# Altium schematic sheet Sheet0-MCU.SchDoc
size A3; SheetNumber: 1; SheetTotal: 4
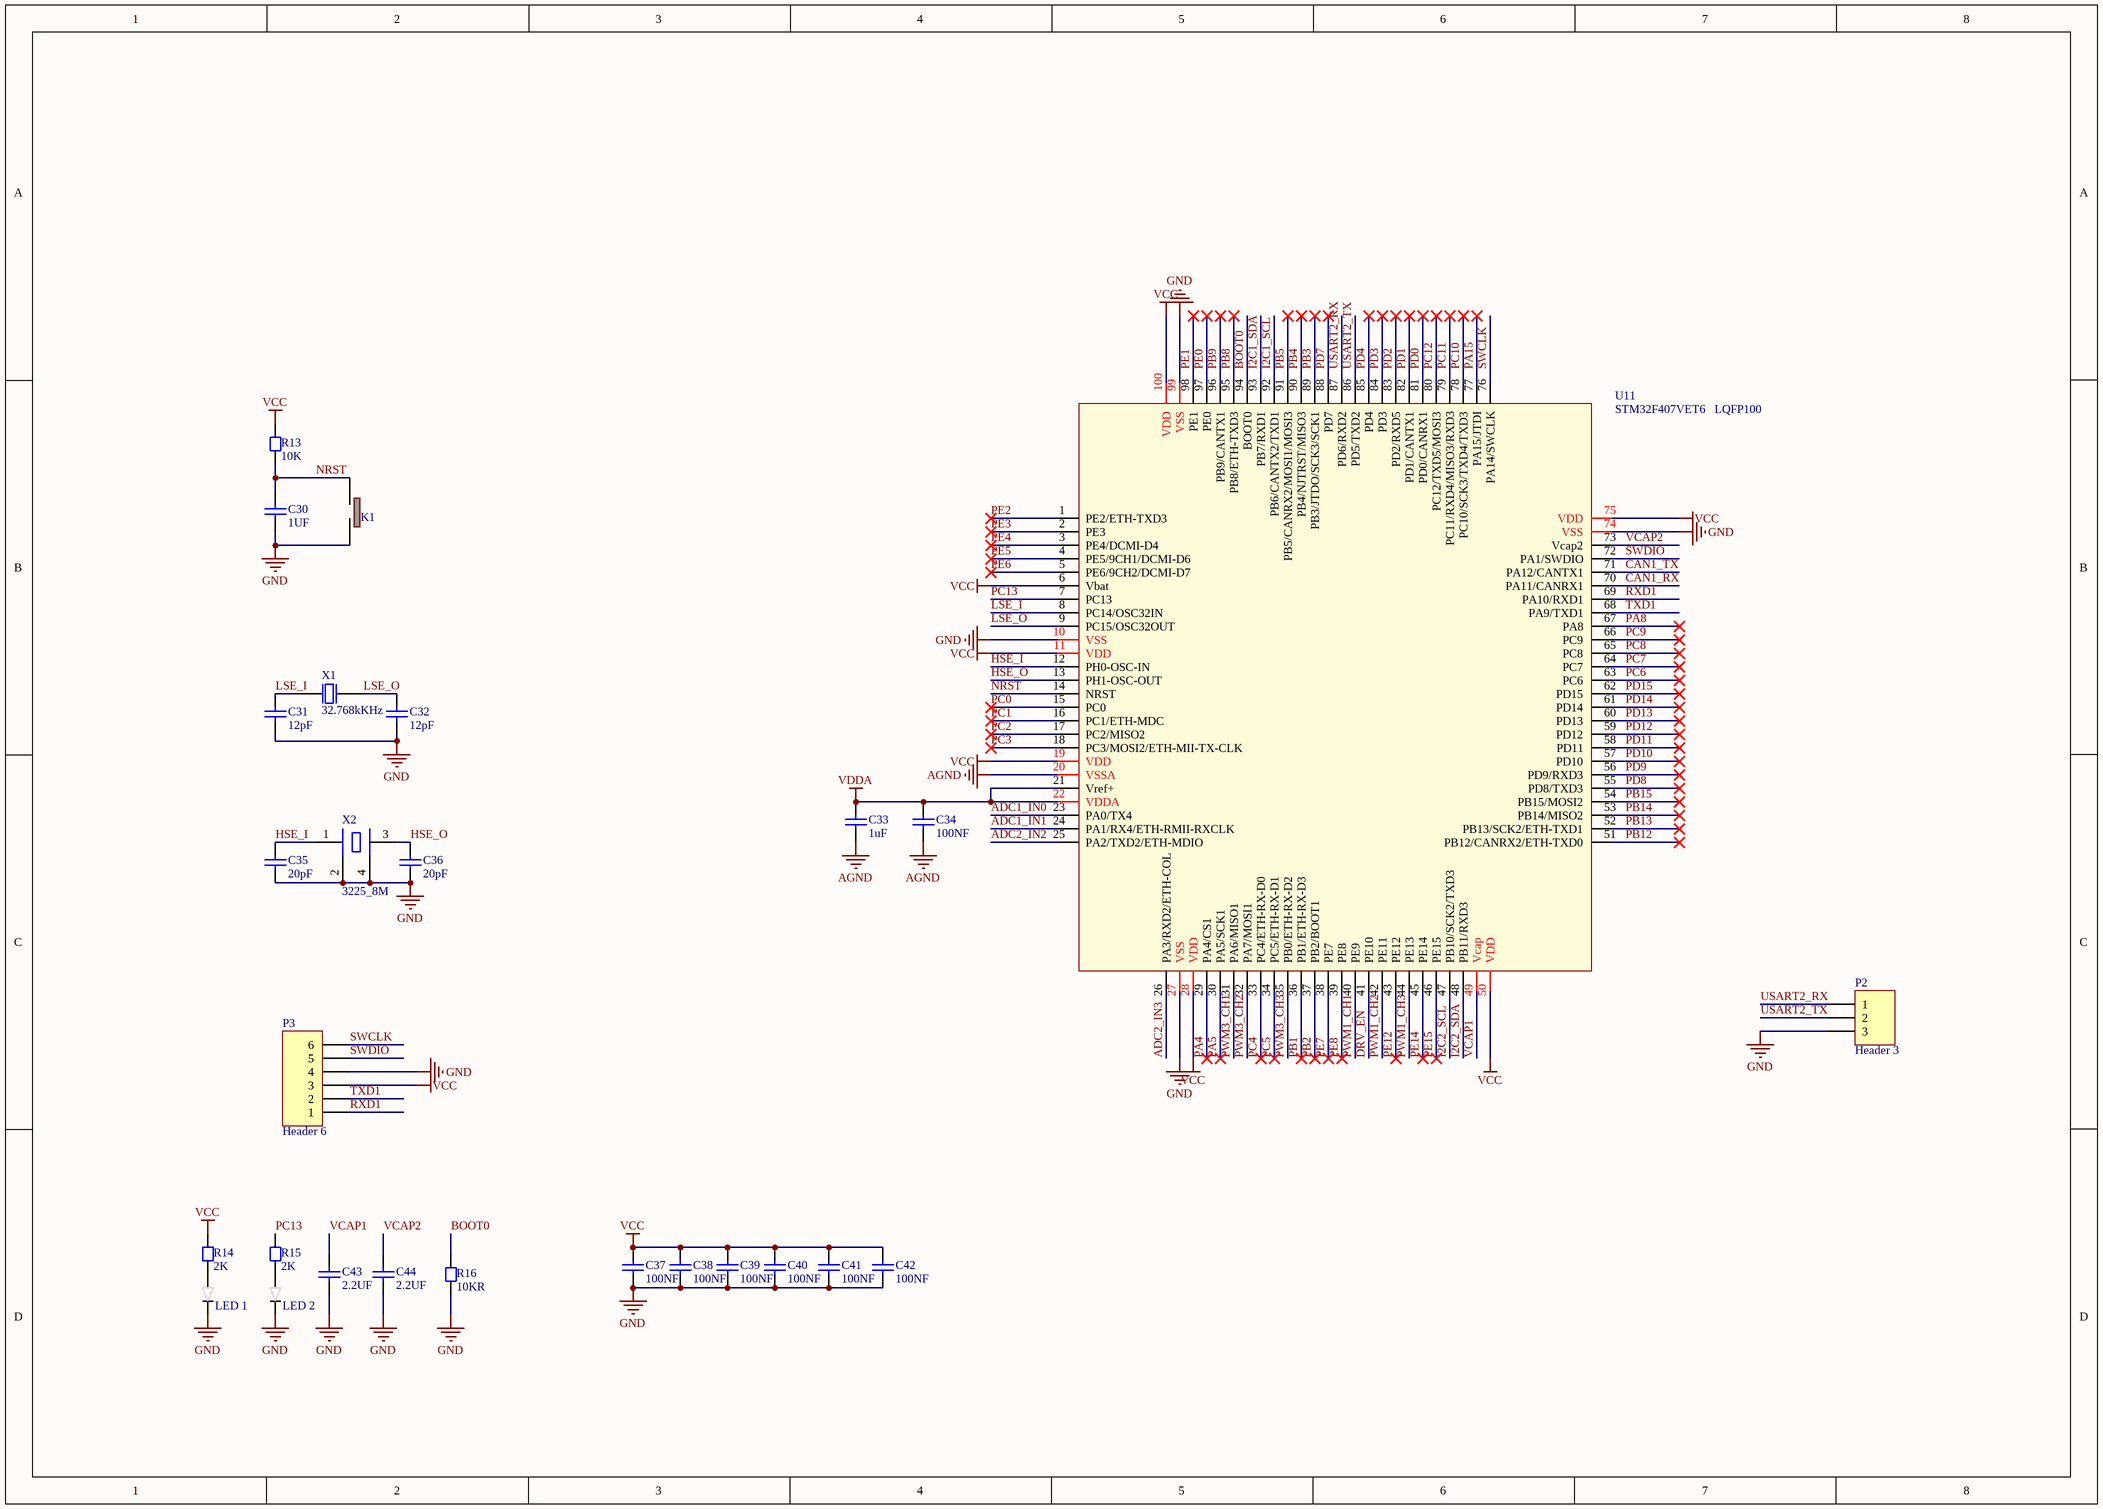
[diagram p0: Sheet0-MCU.SchDoc]

## Parts
C30  1UF  [CC1608-0603]
C31  12pF  [CC1608-0603]
C32  12pF  [CC1608-0603]
C33  1uF  [CC1608-0603]
C34  100NF  [CC1608-0603]
C35  20pF  [CC1608-0603]
C36  20pF  [CC1608-0603]
C37  100NF  [CC1608-0603]
C38  100NF  [CC1608-0603]
C39  100NF  [CC1608-0603]
C40  100NF  [CC1608-0603]
C41  100NF  [CC1608-0603]
C42  100NF  [CC1608-0603]
C43  2.2UF  [CC1608-0603]
C44  2.2UF  [CC1608-0603]
K1  KEY 3*4  [KEY 3*4]  (value not drawn)
LED_1  LED 0603  [LED 0603]  (value not drawn)
LED_2  LED 0603  [LED 0603]  (value not drawn)
P2  Header 3  [HX2.54-3]
P3  Header 6  [HDR1X6]
R13  10K  [CR1608-0603]
R14  2K  [CR1608-0603]
R15  2K  [CR1608-0603]
R16  10KR  [CR1608-0603]
U11  STM32F407VET6   LQFP100  [TQFP100]
X1  32.768kKHz  [XTAL-3215]
X2  3225_8M  [XTAL-3225]

## Nets
AGND: C33.1 C34.1 U11.20(VSSA)
GND: C30.1 C31.1 C32.1 C35.1 C36.1 C37.1 C38.1 C39.1 C40.1 C41.1 C42.1 C43.1 C44.1 K1.2 LED_1.2 LED_2.2 P2.3 P3.4 R16.1 U11.10(VSS) U11.27(VSS) U11.74(VSS) U11.99(VSS) X2.2(GND) X2.4(GND)
VCC: C37.2 C38.2 C39.2 C40.2 C41.2 C42.2 P3.3 R13.2 R14.2 U11.6(Vbat) U11.11(VDD) U11.19(VDD) U11.28(VDD) U11.50(VDD) U11.75(VDD) U11.100(VDD)
VDDA: C33.2 C34.2 U11.21(Vref+) U11.22(VDDA)
ADC1_IN0: U11.23(PA0/TX4)
ADC1_IN1: U11.24(PA1/RX4/ETH-RMII-RXCLK)
ADC2_IN2: U11.25(PA2/TXD2/ETH-MDIO)
ADC2_IN3: U11.26(PA3/RXD2/ETH-COL)
BOOT0: R16.2 U11.94(BOOT0)
CAN1_RX: U11.70(PA11/CANRX1)
CAN1_TX: U11.71(PA12/CANTX1)
DRV_EN: U11.41(PE10)
HSE_I: C35.2 U11.12(PH0-OSC-IN) X2.1(OSC1)
HSE_O: C36.2 U11.13(PH1-OSC-OUT) X2.3(OSC2)
I2C1_SCL: U11.92(PB6/CANTX2/TXD1)
I2C1_SDA: U11.93(PB7/RXD1)
I2C2_SCL: U11.47(PB10/SCK2/TXD3)
I2C2_SDA: U11.48(PB11/RXD3)
LSE_I: C31.2 U11.8(PC14/OSC32IN) X1.1(OSC1)
LSE_O: C32.2 U11.9(PC15/OSC32OUT) X1.2(OSC2)
NRST: C30.2 K1.1 R13.1 U11.14(NRST)
PA4: U11.29(PA4/CS1)
PA5: U11.30(PA5/SCK1)
PA8: U11.67(PA8)
PA15: U11.77(PA15/JTDI)
PB1: U11.36(PB1/ETH-RX-D3)
PB2: U11.37(PB2/BOOT1)
PB3: U11.89(PB3/JTDO/SCK3/SCK1)
PB4: U11.90(PB4/NJTRST/MISO3)
PB5: U11.91(PB5/CANRX2/MOSI1/MOSI3)
PB8: U11.95(PB8/ETH-TXD3)
PB9: U11.96(PB9/CANTX1)
PB12: U11.51(PB12/CANRX2/ETH-TXD0)
PB13: U11.52(PB13/SCK2/ETH-TXD1)
PB14: U11.53(PB14/MISO2)
PB15: U11.54(PB15/MOSI2)
PC0: U11.15(PC0)
PC1: U11.16(PC1/ETH-MDC)
PC2: U11.17(PC2/MISO2)
PC3: U11.18(PC3/MOSI2/ETH-MII-TX-CLK)
PC4: U11.33(PC4/ETH-RX-D0)
PC5: U11.34(PC5/ETH-RX-D1)
PC6: U11.63(PC6)
PC7: U11.64(PC7)
PC8: U11.65(PC8)
PC9: U11.66(PC9)
PC10: U11.78(PC10/SCK3/TXD4/TXD3)
PC11: U11.79(PC11/RXD4/MISO3/RXD3)
PC12: U11.80(PC12/TXD5/MOSI3)
PC13: R15.2 U11.7(PC13)
PD0: U11.81(PD0/CANRX1)
PD1: U11.82(PD1/CANTX1)
PD2: U11.83(PD2/RXD5)
PD3: U11.84(PD3)
PD4: U11.85(PD4)
PD7: U11.88(PD7)
PD8: U11.55(PD8/TXD3)
PD9: U11.56(PD9/RXD3)
PD10: U11.57(PD10)
PD11: U11.58(PD11)
PD12: U11.59(PD12)
PD13: U11.60(PD13)
PD14: U11.61(PD14)
PD15: U11.62(PD15)
PE0: U11.97(PE0)
PE1: U11.98(PE1)
PE2: U11.1(PE2/ETH-TXD3)
PE3: U11.2(PE3)
PE4: U11.3(PE4/DCMI-D4)
PE5: U11.4(PE5/9CH1/DCMI-D6)
PE6: U11.5(PE6/9CH2/DCMI-D7)
PE7: U11.38(PE7)
PE8: U11.39(PE8)
PE12: U11.43(PE12)
PE14: U11.45(PE14)
PE15: U11.46(PE15)
PWM1_CH1: U11.40(PE9)
PWM1_CH2: U11.42(PE11)
PWM1_CH3: U11.44(PE13)
PWM3_CH1: U11.31(PA6/MISO1)
PWM3_CH2: U11.32(PA7/MOSI1)
PWM3_CH3: U11.35(PB0/ETH-RX-D2)
RXD1: P3.1 U11.69(PA10/RXD1)
SWCLK: P3.6 U11.76(PA14/SWCLK)
SWDIO: P3.5 U11.72(PA1/SWDIO)
TXD1: P3.2 U11.68(PA9/TXD1)
USART2_RX: P2.1 U11.87(PD6/RXD2)
USART2_TX: P2.2 U11.86(PD5/TXD2)
VCAP1: C43.2 U11.49(Vcap)
VCAP2: C44.2 U11.73(Vcap2)
NetLED_1_1: LED_1.1 R14.1
NetLED_2_1: LED_2.1 R15.1

## Library data of the parts
C30-C44 = Cap Chip 0603: 0603封装的电容; Published: 8-Jun-2000; Revision: July-2002: Re-released for DXP Platform.; Publisher: Altium Limited
K1 = KEY 3*4: 轻触开关按键
P2 = Header 3: Header, 3-Pin; LatestRevisionDate: 17-Jul-2002; LatestRevisionNote: Re-released for DXP Platform.; Publisher: Altium Limited
P3 = Header 6: Header, 6-Pin; LatestRevisionDate: 17-Jul-2002; LatestRevisionNote: Re-released for DXP Platform.; Publisher: Altium Limited
R13-R16 = Resistor Chip 0603: 0603封装电阻; Published: 8-Jun-2000; Revision: July-2002: Re-released for DXP Platform.; Publisher: Altium Limited
U11 = STM32F407VET6: 168M单片机
X1 = XTAL 3215 32.768kKHz: 3215封装的时钟晶振
X2 = XTAL 3225: 3225封装的晶振